# Altium schematic sheet Power.SchDoc
size 165 x 127 mm
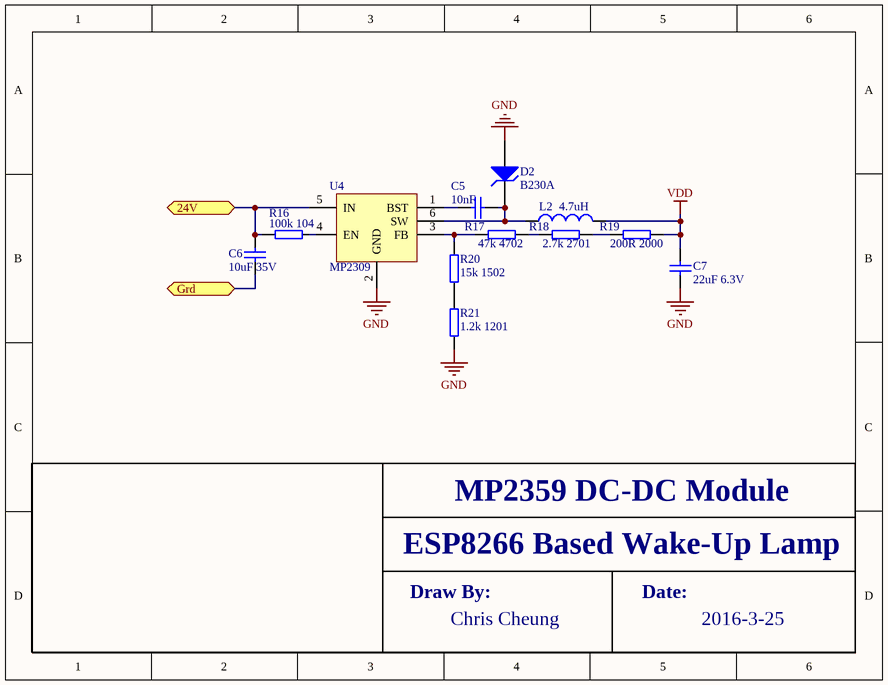
[diagram p0: Power.SchDoc]

## Parts
C5  value 10nF  [RAD-0.3]  (hidden comment: Cap)
C6  value 10uF 35V  [RAD-0.3]  (hidden comment: Cap)
C7  value 22uF 6.3V  [RAD-0.3]  (hidden comment: Cap)
D2  B230A  [DIODE-0.7]
L2  value 4.7uH  [0402-A]  (hidden comment: Inductor)
R16  100k 104  [SMT_R_0402]
R17  47k 4702  [SMT_R_0402]
R18  2.7k 2701  [SMT_R_0402]
R19  200R 2000  [SMT_R_0402]
R20  15k 1502  [SMT_R_0402]
R21  1.2k 1201  [SMT_R_0402]
U4  MP2309

## Ports
24V, Grd

## Nets
GND: C7.1 D2.1(A) R21.1 U4.2(GND)
VDD: C7.2 L2.2 R19.2
24V: C6.2 R16.1 U4.5(IN) ; port 24V
Grd: C6.1 ; port Grd
NetC5_1: C5.1 D2.2(K) L2.1 U4.6(SW)
NetC5_2: C5.2 U4.1(BST)
NetR16_2: R16.2 U4.4(EN)
NetR17_1: R17.1 R20.2 U4.3(FB)
NetR17_2: R17.2 R18.1
NetR18_2: R18.2 R19.1
NetR20_1: R20.1 R21.2

## Notes on the sheet
- MP2359 DC-DC Module
- ESP8266 Based Wake-Up Lamp
- Draw By:
- Chris Cheung
- Date:
- 2016-3-25

## Library data of the parts
C5-C7 = Cap: Capacitor; Published: 8-Jun-2000; LatestRevisionDate: 17-Jul-2002; LatestRevisionNote: Re-released for DXP Platform.; PackageReference: RAD-0.3; Publisher: Altium Limited; PackageDescription: Radial Cap, Thru-Hole; 2 Leads; 0.3 in Pin Spacing
D2 = D Zener: Zener Diode; Published: 8-Jun-2000; LatestRevisionDate: 17-Jul-2002; LatestRevisionNote: Re-released for DXP Platform.; PackageReference: DIODE-0.7; Publisher: Altium Limited; PackageDescription: Diode, Thru-Hole; 2 Leads; 0.7 in Pin Spacing
L2 = Inductor: Code_IEC: 1005; Published: 8-Jun-2000; LatestRevisionDate: 29-May-2009; LatestRevisionNote: IPC-7351 Footprint Added.; PackageReference: 0402-A; Publisher: Altium Limited; PackageDescription: Chip Inductor; Code_JEITA: 0402
R16-R21 = SMT_R_0402: Surface mount resistor 0402